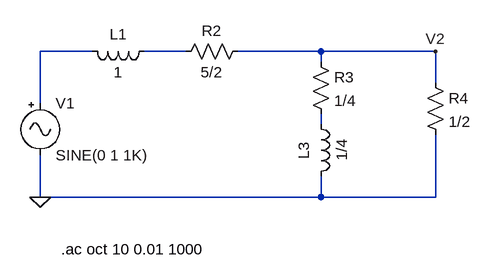
[diagram p0: schematic Ej2.asc]
Ej2.asc, the LTspice schematic file:
Version 4
SHEET 1 880 680
WIRE 192 304 112 304
WIRE 336 304 272 304
WIRE 544 304 416 304
WIRE 720 304 544 304
WIRE 544 320 544 304
WIRE 720 352 720 304
WIRE 112 384 112 304
WIRE 544 416 544 400
WIRE 112 528 112 464
WIRE 544 528 544 496
WIRE 544 528 112 528
WIRE 720 528 720 432
WIRE 720 528 544 528
FLAG 112 528 0
FLAG 720 304 V2
SYMBOL Ind 288 288 R90
WINDOW 0 5 56 VBottom 2
WINDOW 3 32 56 VTop 2
SYMATTR InstName L1
SYMATTR Value 1
SYMBOL Ind 528 400 R0
WINDOW 0 5 56 VBottom 2
WINDOW 3 32 56 VTop 2
SYMATTR InstName L3
SYMATTR Value 1/4
SYMBOL Res 432 288 R90
WINDOW 0 0 56 VBottom 2
WINDOW 3 32 56 VTop 2
SYMATTR InstName R2
SYMATTR Value 5/2
SYMBOL Res 528 304 R0
SYMATTR InstName R3
SYMATTR Value 1/4
SYMBOL Res 704 336 R0
SYMATTR InstName R4
SYMATTR Value 1/2
SYMBOL Misc/signal 112 368 R0
SYMATTR InstName V1
SYMATTR Value2 AC 1
TEXT 144 608 Left 2 !.ac oct 10 0.01 1000

The netlist it stands for:
* Ej2.asc
L1 N002 N001 1
L3 N003 0 1/4
R2 V2 N002 5/2
R3 V2 N003 1/4
R4 V2 0 1/2
V1 N001 0 SINE(0 1 1K) AC 1
.ac oct 10 0.01 1000
.backanno
.end